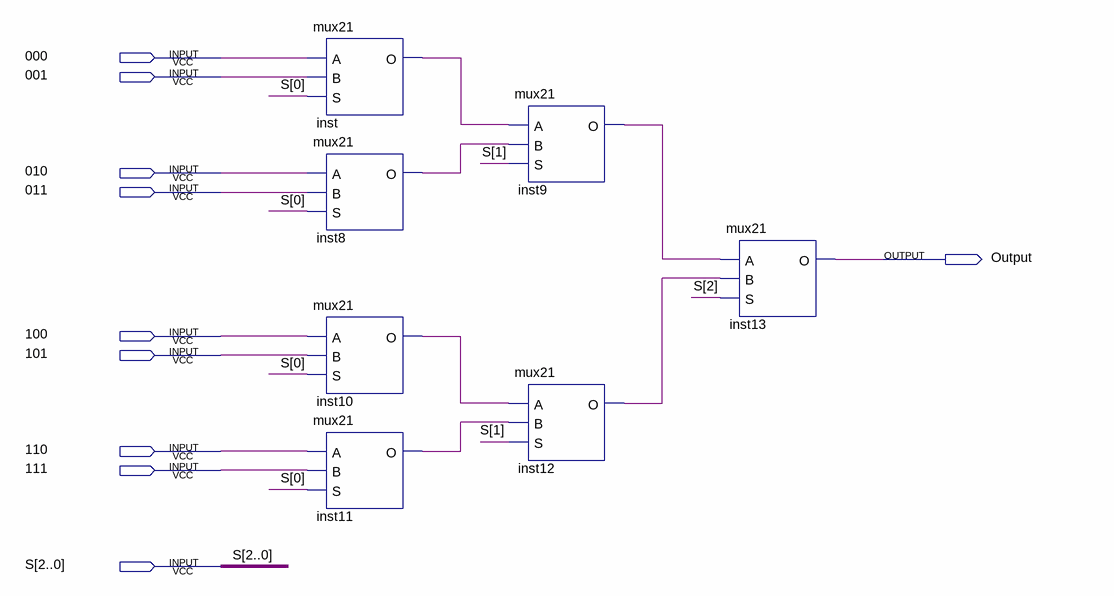
[diagram p0: schematic sheet]
// Quartus schematic mux81.bdf as structural Verilog: 7 symbols, 10 pins
module mux81 (
  input  \000 ,
  input  \001 ,
  input  \010 ,
  input  \011 ,
  input  \100 ,
  input  \101 ,
  input  \110 ,
  input  \111 ,
  input  [2:0] S,
  output Output
);

  wire inst8_o, inst9_o, inst10_o, inst11_o, inst12_o, inst_o;

  mux21 inst (.A(\000 ), .B(\001 ), .S(S[0]), .O(inst_o));
  mux21 inst8 (.A(\010 ), .B(\011 ), .S(S[0]), .O(inst8_o));
  mux21 inst10 (.A(\100 ), .B(\101 ), .S(S[0]), .O(inst10_o));
  mux21 inst11 (.A(\110 ), .B(\111 ), .S(S[0]), .O(inst11_o));
  mux21 inst9 (.A(inst_o), .B(inst8_o), .S(S[1]), .O(inst9_o));
  mux21 inst12 (.A(inst10_o), .B(inst11_o), .S(S[1]), .O(inst12_o));
  mux21 inst13 (.A(inst9_o), .B(inst12_o), .S(S[2]), .O(Output));
endmodule
